# EAGLE design GWLSensorv6 (EAGLE 9.5.2)
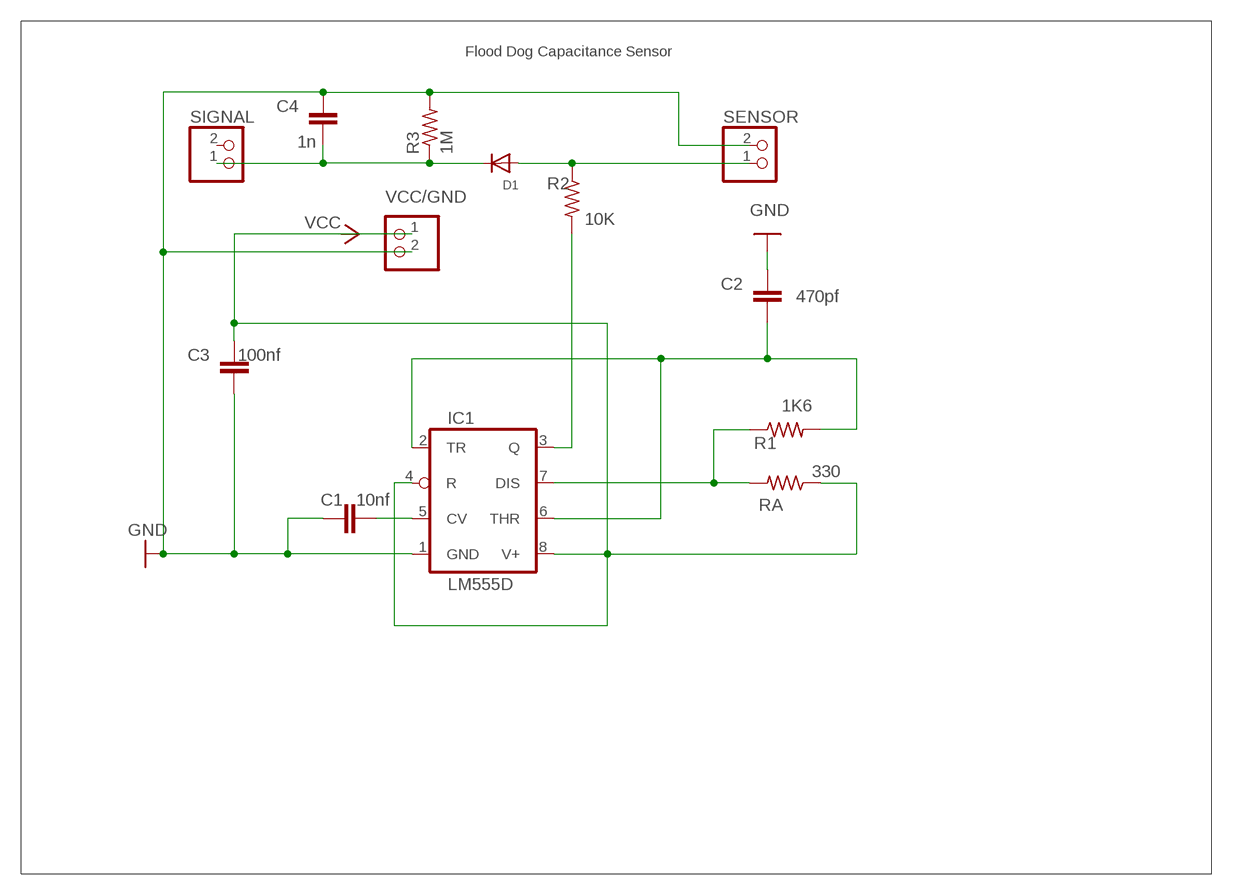
[diagram p0: schematic, sheet 1]

## Parts
C1  10nf  C-EUC0805  [C0805]
C2  470pf  C-EUC0805  [C0805]
C3  100nf  C-EUC0805  [C0805]
C4  1n  C-EUC0805  [C0805]
D1  DIODESMA  [SMADIODE]
IC1  LM555D  [SO08]
R1  1K6  R-US_R0805  [R0805]
R2  10K  R-US_R0805  [R0805]
R3  1M  R-US_R0805  [R0805]
RA  330  R-US_R0805  [R0805]
SENSOR  JST_2PIN-SMT  [JST-PH-2-SMT]
SIGNAL  JST_2PIN-SMT  [JST-PH-2-SMT]
VCC/GND  JST_2PIN-SMT  [JST-PH-2-SMT]

## Nets
GND: C1.1 C2.2 C3.1 C4.2 IC1.1(GND) R3.2 SENSOR.2 VCC/GND.2
N$1: C4.1 D1.C R3.1 SIGNAL.1
N$2: IC1.7(DIS) R1.1 RA.2
N$3: C2.1 IC1.2(TR) IC1.6(THR) R1.2
N$4: C1.2 IC1.5(CV)
N$6: D1.A R2.1 SENSOR.1
N$7: IC1.3(Q) R2.2
VCC: C3.2 IC1.4(R) IC1.8(V+) RA.1 VCC/GND.1
Unconnected: SIGNAL.2

## Notes on the sheet
- Flood Dog Capacitance Sensor

## Library data of the parts
C1-C4 = rcl:C-EU: CAPACITOR, European symbol
D1 = adafruit:DIODE: Diode SMADIODE - SMA Surface Mount Package 20V 1A Schottky Diode Digikey: 641-1014-6-ND DO-1N4148 - Through Hole Small Current Diode SOD-123 20V 1 A (.5mV Vf) Schottky Diode - Digikey: MBRX120TPMSCT-ND SOD-323 10V 570mA (.38mV Vf, 3ns) Schottky Diode - Digikey: ZLLS410CT-ND SOD-523 30V 30mA Schottky Diode (RB751S-40TE61) - Digikey: RB751S-40TE61CT-ND SOT23-R/W - SOT23 Package (R = Solder Paste/Reflow Ovens, W = Hand-Soldering) BAT54Film 40V 300mA - Digikey: 497-7162-1-ND
IC1 = linear:*555: TIMER
R1-R3 RA = rcl:R-US_: RESISTOR, American symbol
SENSOR SIGNAL VCC/GND = adafruit:JST_2PIN: JST 2-Pin Connectors of various flavors SMT-RA (S2B-PH-SM4) 4UConnector #17311 SMT (B2B-PH-SM4) THM-RA (S2B-PH) THM (B2B-PH)

## Board
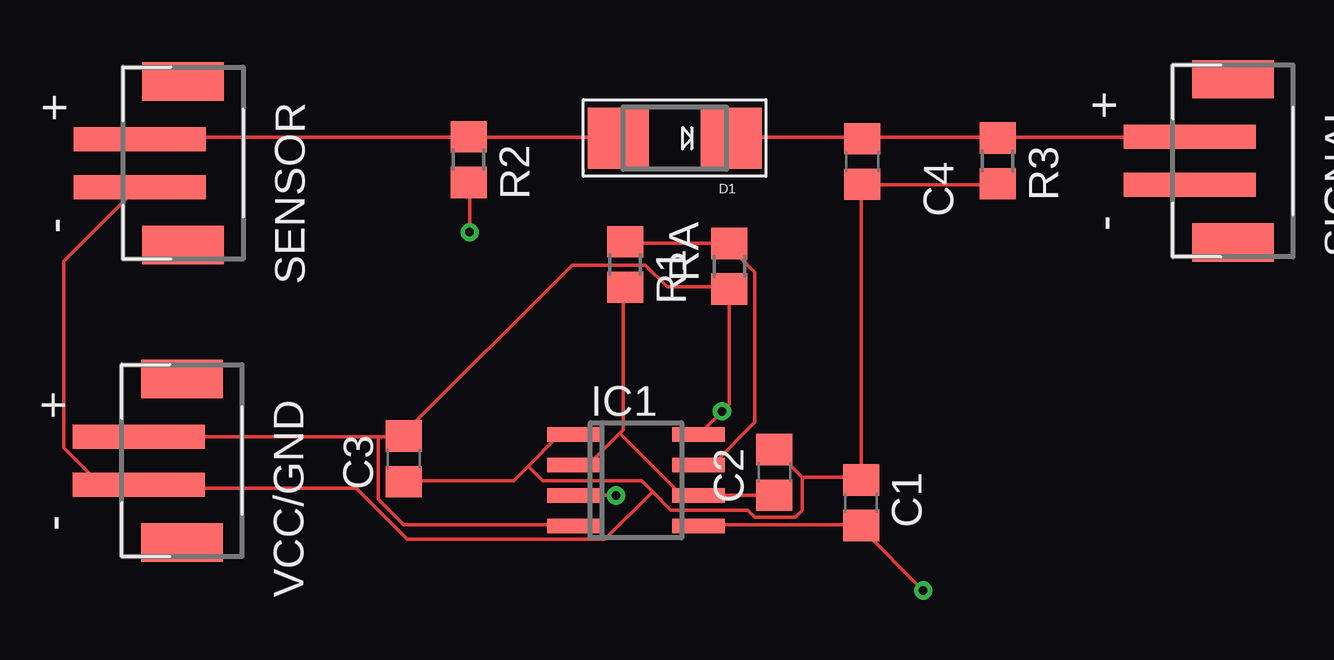
[diagram p1: board, top side]
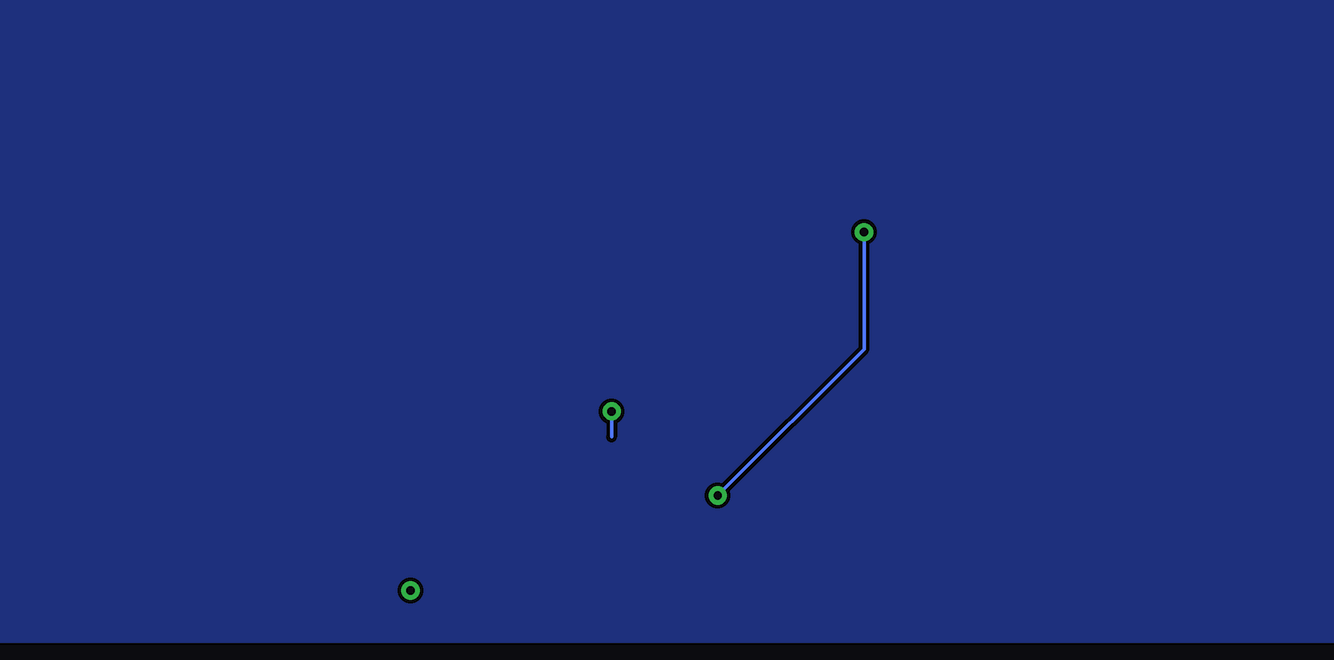
[diagram p2: board, bottom side, seen from below]

No outline drawn. Coordinates in mm, seen from the top.
Copper layers (1*16): Top 0.035mm / dielectric 1.5mm / Bottom 0.035mm
Design rules "default": minimum track width 6mil, minimum drill 0.35mm, track to track 6mil, track to pad 6mil, pad to pad 6mil, via to via 6mil, smd to smd 6mil, copper to edge 40mil, drill to drill 6mil, minimum pad ring 10mil, minimum via ring 8mil, stop-mask expansion 4mil, vias tented up to drill 0mil, thermal gap 10mil

### Footprints (pad centres in the part's own frame; a part is rotated, then mirrored left to right if it is on the bottom)
C0805 = smd 1.3 x 1.5: 1 -0.95,0; 2 0.95,0
SMADIODE = smd 2.54 x 2.54: A 2.349,0; C -2.349,0
SO08 = smd 0.6 x 2.2: 1 -1.905,-2.6; 2 -0.635,-2.6; 3 0.635,-2.6; 4 1.905,-2.6; 5 1.905,2.6; 6 0.635,2.6; 7 -0.635,2.6; 8 -1.905,2.6
R0805 = smd 1.3 x 1.5: 1 -0.95,0; 2 0.95,0
JST-PH-2-SMT = smd 1 x 5.5: 1 -1,-1.8; 2 1,-1.8 | smd 1.6 x 3.4: NC1 -3.4,0; NC2 3.4,0

### Placement (x,y rotation side)
C1  15.09,38.86 270 top
C2  11.48,40.13 90 top
C3  -3.96,40.69 90 top
C4  15.14,53.09 270 top
D1  7.33,54.06 180 top
IC1  5.71,39.8 270 top
R1  5.26,48.79 270 top
R2  -1.26,53.16 270 top
R3  20.78,53.11 270 top
RA  9.6,48.72 90 top
SENSOR  -13.16,53.01 270 top
SIGNAL  30.58,53.11 270 top
VCC/GND  -13.21,40.61 270 top

### Tracks (layer width: path | path; a pad name or v marks a point on that pad's centre or on a via)
GND
  Top 0.152: SENSOR.2 -15.09,51.97 -18.14,48.92 -18.14,41.15 -16.61,39.62 -15.09,39.62 VCC/GND.2 -14.94,39.47 -5.94,39.47 -3.81,37.34 4.42,37.34 6.4,39.32 | 1.22,40.39 2.44,41.6 3.05,41.6 IC1.1 | 1.22,40.39 0.61,39.78 -3.96,39.78 C3.1 | 12.65,39.93 15.09,39.93 | 12.65,39.93 11.58,41 C2.2 | R3.2 20.73,52.12 15.24,52.12 C4.2 15.09,52.12 15.09,39.93 | 15.09,39.93 C1.1 | 1.22,40.39 1.83,39.78 5.94,39.78 6.4,39.32 | 6.4,39.32 7.16,38.56 10.36,38.56 10.67,38.25 12.34,38.25 12.65,38.56 12.65,39.93
  pour Bottom: -23.8,60.45 -23.8,33.1 -22.28,33.1 38.35,33.1 38.35,60.2 38.35,60.6 -23.72,60.6
N$1
  Top 0.152: D1.C 9.75,54.1 15.09,54.1 C4.1 15.24,54.1 20.73,54.1 R3.1 20.88,54.1 28.65,54.1 SIGNAL.1
N$2
  Top 0.152: R1.1 5.33,49.68 9.6,49.68 RA.2 9.6,49.53 10.67,48.46 10.67,42.22 8.99,40.54 8.38,40.54 IC1.7
N$3
  Top 0.152: C2.1 11.43,39.17 IC1.6 7.62,39.17 5.03,41.76 | 5.03,41.76 3.81,40.54 3.2,40.54 IC1.2 | 5.03,41.76 5.18,41.91 5.18,47.7 R1.2
N$4  (via drill 0.35)
  Top 0.152: IC1.5 8.38,37.95 15.09,37.95 C1.2 15.09,37.8 v17.68,35.2
N$6
  Top 0.152: D1.A 4.88,54.1 -1.22,54.1 R2.1 -1.37,54.1 -14.94,54.1 SENSOR.1
N$7  (via drill 0.35)
  Top 0.152: v-1.22,50.14 -1.22,52.12 R2.2 | v4.88,39.17 IC1.3
  Bottom 0.152: v-1.22,50.14 -1.22,45.26 v4.88,39.17
VCC  (via drill 0.35)
  Top 0.152: IC1.8 8.38,41.76 v9.3,42.67 9.6,42.98 RA.1 9.6,47.85 7.01,47.85 6.1,48.77 3.05,48.77 -3.96,41.76 C3.2 -3.96,41.6 -5.03,41.6 | -5.03,41.6 -14.94,41.6 VCC/GND.1 | -5.03,41.6 -5.03,39.01 -3.96,37.95 3.05,37.95 IC1.4
  Bottom 0.152: v9.3,42.67 9.3,41.6